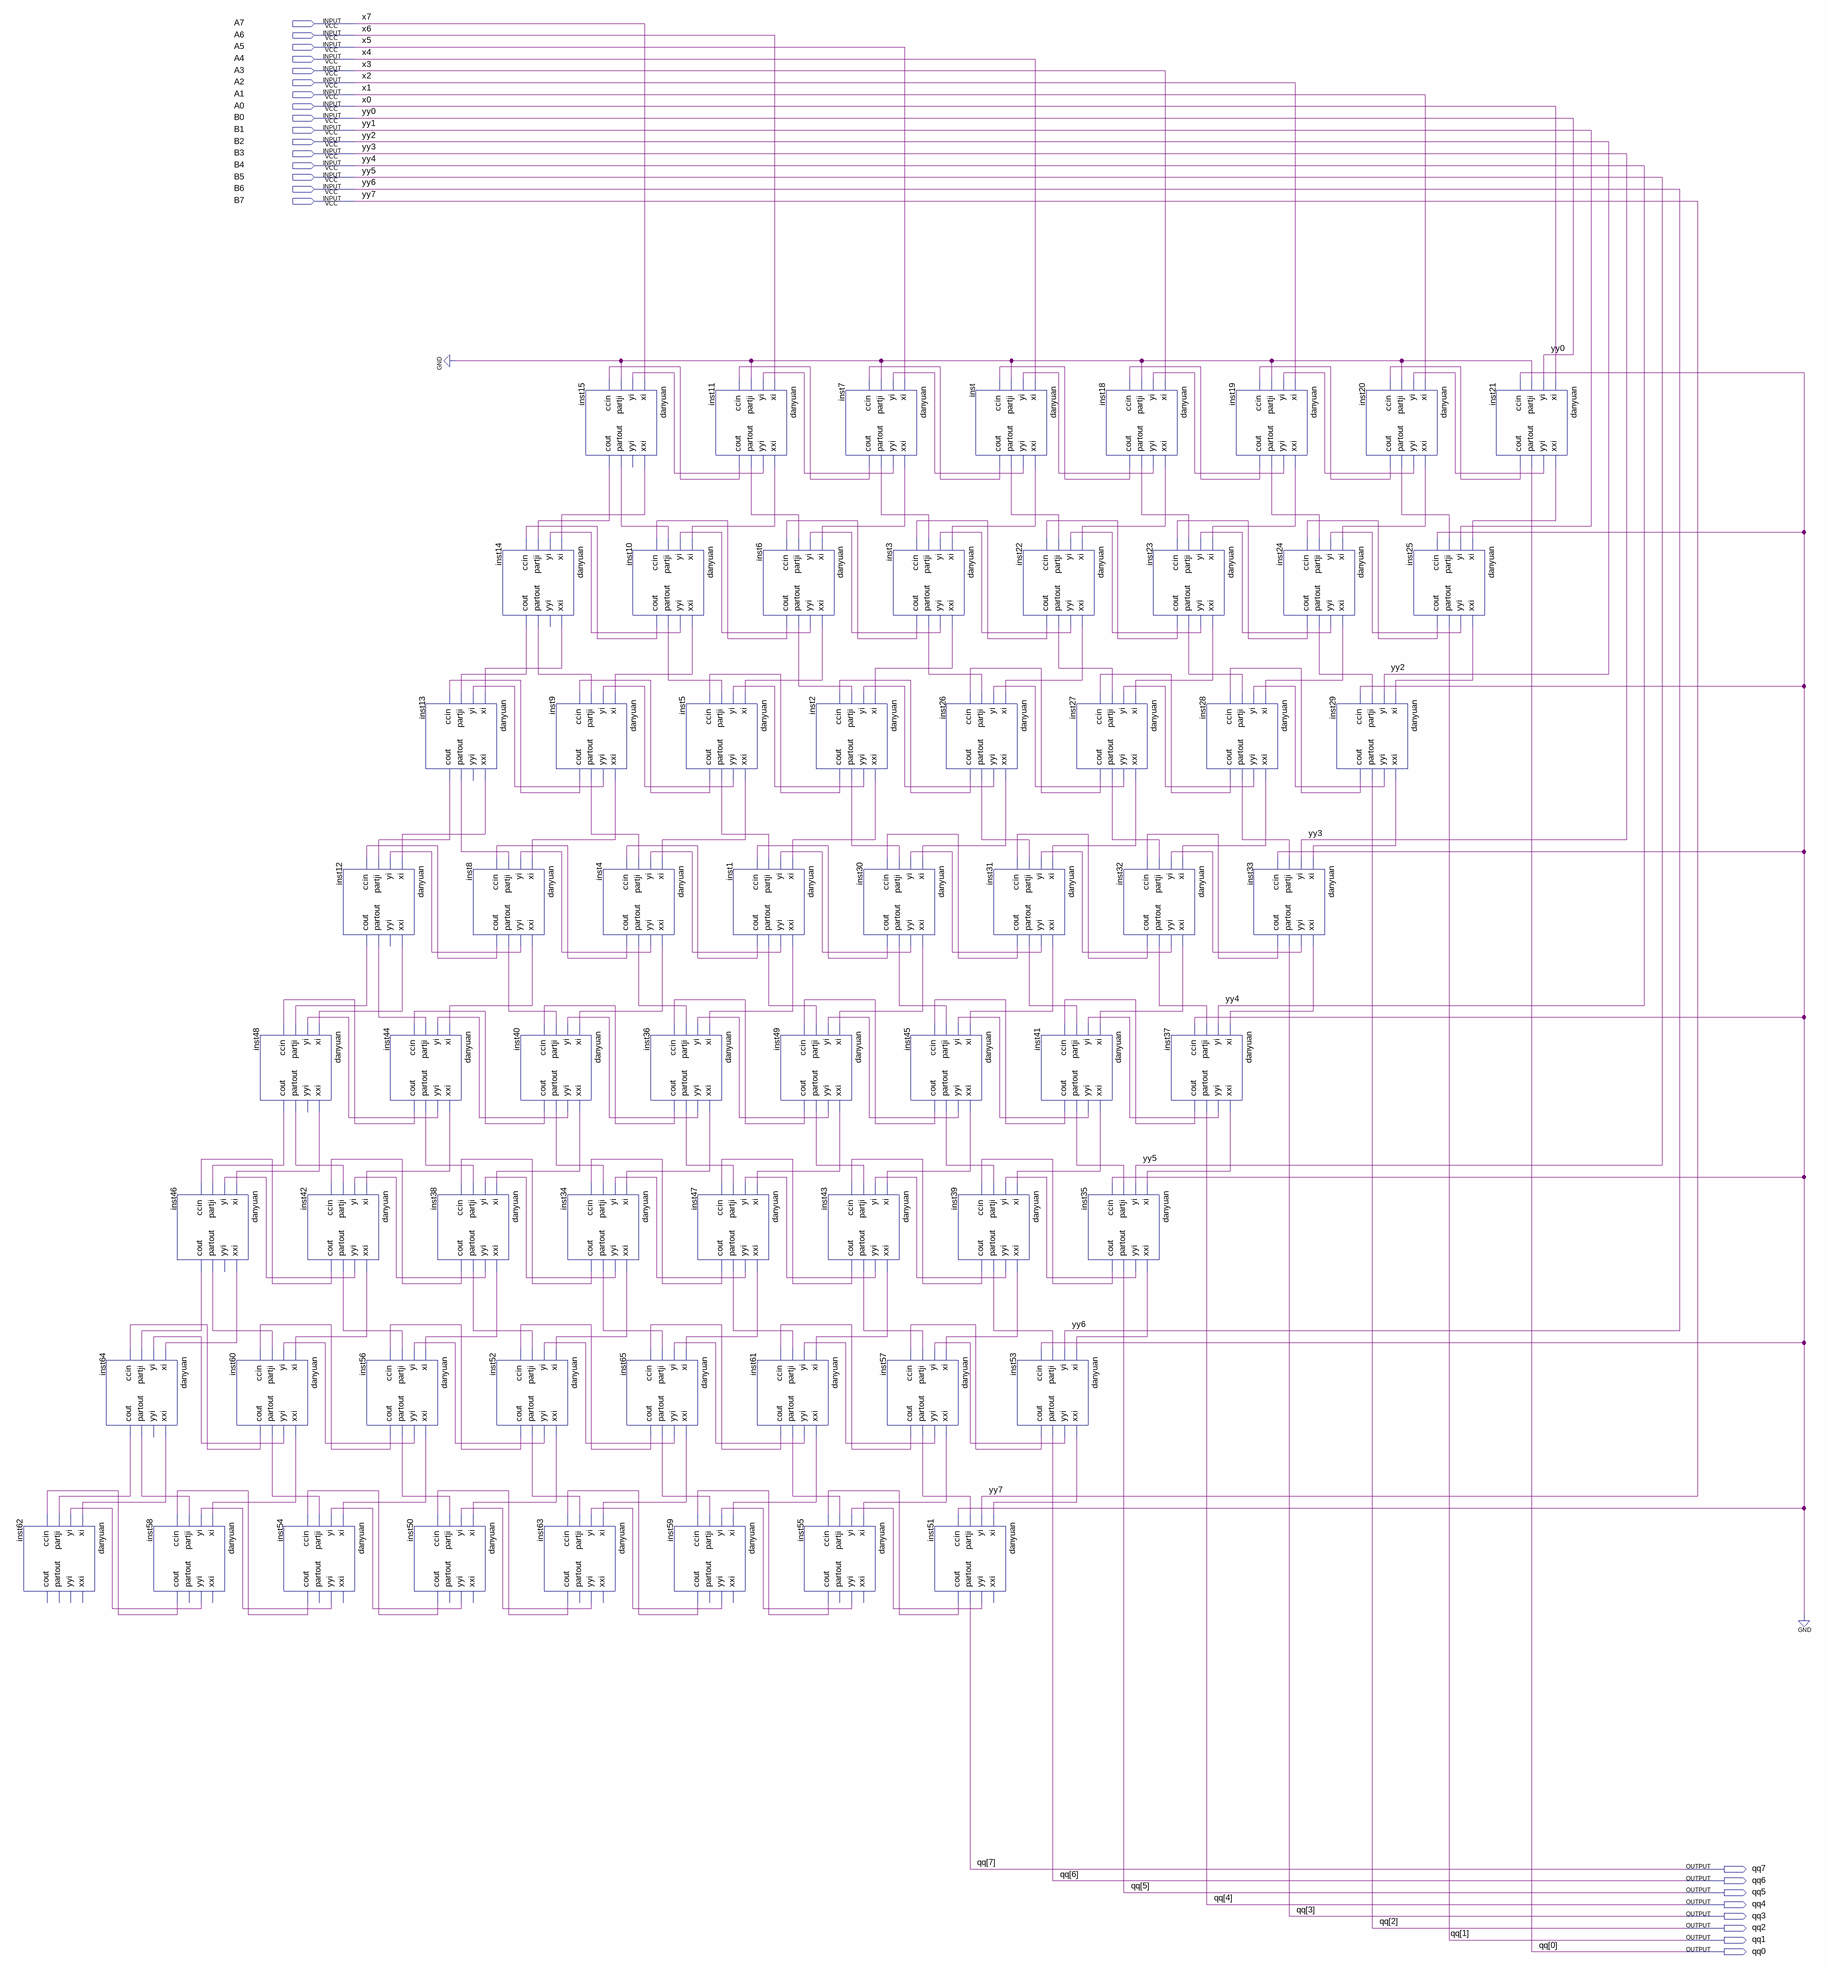
[diagram p0: schematic sheet]
// Quartus schematic multiply.bdf as structural Verilog: 64 symbols, 24 pins
module multiply (
  input  A7,
  input  A6,
  input  A5,
  input  A4,
  input  A3,
  input  A2,
  input  A1,
  input  A0,
  input  B0,
  input  B1,
  input  B2,
  input  B3,
  input  B4,
  input  B5,
  input  B6,
  input  B7,
  output qq7,
  output qq6,
  output qq5,
  output qq4,
  output qq3,
  output qq2,
  output qq1,
  output qq0
);

  wire inst1_cout, inst1_partout, inst1_xxi, inst1_yyi, inst2_cout, inst2_partout, inst2_xxi, inst2_yyi,
       inst3_cout, inst3_partout, inst3_xxi, inst3_yyi, inst4_cout, inst4_partout, inst4_xxi, inst4_yyi,
       inst5_cout, inst5_partout, inst5_xxi, inst5_yyi, inst6_cout, inst6_partout, inst6_xxi, inst6_yyi,
       inst7_cout, inst7_partout, inst7_xxi, inst7_yyi, inst8_cout, inst8_partout, inst8_xxi, inst8_yyi,
       inst9_cout, inst9_partout, inst9_xxi, inst9_yyi, inst10_cout, inst10_partout, inst10_xxi, inst10_yyi,
       inst11_cout, inst11_partout, inst11_xxi, inst11_yyi, inst12_cout, inst12_partout, inst12_xxi,
       inst13_cout, inst13_partout, inst13_xxi, inst14_cout, inst14_partout, inst14_xxi, inst15_cout,
       inst15_partout, inst15_xxi, inst18_cout, inst18_partout, inst18_xxi, inst18_yyi, inst19_cout,
       inst19_partout, inst19_xxi, inst19_yyi, inst20_cout, inst20_partout, inst20_xxi, inst20_yyi,
       inst21_cout, inst21_xxi, inst21_yyi, inst22_cout, inst22_partout, inst22_xxi, inst22_yyi, inst23_cout,
       inst23_partout, inst23_xxi, inst23_yyi, inst24_cout, inst24_partout, inst24_xxi, inst24_yyi,
       inst25_cout, inst25_xxi, inst25_yyi, inst26_cout, inst26_partout, inst26_xxi, inst26_yyi, inst27_cout,
       inst27_partout, inst27_xxi, inst27_yyi, inst28_cout, inst28_partout, inst28_xxi, inst28_yyi,
       inst29_cout, inst29_xxi, inst29_yyi, inst30_cout, inst30_partout, inst30_xxi, inst30_yyi, inst31_cout,
       inst31_partout, inst31_xxi, inst31_yyi, inst32_cout, inst32_partout, inst32_xxi, inst32_yyi,
       inst33_cout, inst33_xxi, inst33_yyi, inst34_cout, inst34_partout, inst34_xxi, inst34_yyi, inst35_cout,
       inst35_xxi, inst35_yyi, inst36_cout, inst36_partout, inst36_xxi, inst36_yyi, inst37_cout, inst37_xxi,
       inst37_yyi, inst38_cout, inst38_partout, inst38_xxi, inst38_yyi, inst39_cout, inst39_partout,
       inst39_xxi, inst39_yyi, inst40_cout, inst40_partout, inst40_xxi, inst40_yyi, inst41_cout,
       inst41_partout, inst41_xxi, inst41_yyi, inst42_cout, inst42_partout, inst42_xxi, inst42_yyi,
       inst43_cout, inst43_partout, inst43_xxi, inst43_yyi, inst44_cout, inst44_partout, inst44_xxi,
       inst44_yyi, inst45_cout, inst45_partout, inst45_xxi, inst45_yyi, inst46_cout, inst46_partout,
       inst46_xxi, inst47_cout, inst47_partout, inst47_xxi, inst47_yyi, inst48_cout, inst48_partout,
       inst48_xxi, inst49_cout, inst49_partout, inst49_xxi, inst49_yyi, inst50_cout, inst50_yyi, inst51_cout,
       inst51_yyi, inst52_cout, inst52_partout, inst52_xxi, inst52_yyi, inst53_cout, inst53_xxi, inst53_yyi,
       inst54_cout, inst54_yyi, inst55_cout, inst55_yyi, inst56_cout, inst56_partout, inst56_xxi, inst56_yyi,
       inst57_cout, inst57_partout, inst57_xxi, inst57_yyi, inst58_cout, inst58_yyi, inst59_cout, inst59_yyi,
       inst60_cout, inst60_partout, inst60_xxi, inst60_yyi, inst61_cout, inst61_partout, inst61_xxi,
       inst61_yyi, inst63_cout, inst63_yyi, inst64_cout, inst64_partout, inst64_xxi, inst65_cout,
       inst65_partout, inst65_xxi, inst65_yyi, inst_cout, inst_partout, inst_xxi, inst_yyi;

  danyuan inst62 (
    .xi(inst64_xxi), .yi(inst58_yyi), .partji(inst64_cout), .ccin(inst58_cout));  // open: xxi, yyi, partout, cout
  danyuan inst64 (
    .xi(inst46_xxi), .yi(inst60_yyi), .partji(inst46_cout), .ccin(inst60_cout), .xxi(inst64_xxi),
    .partout(inst64_partout), .cout(inst64_cout));  // open: yyi
  danyuan inst58 (
    .xi(inst60_xxi), .yi(inst54_yyi), .partji(inst64_partout), .ccin(inst54_cout), .yyi(inst58_yyi),
    .cout(inst58_cout));  // open: xxi, partout
  danyuan inst46 (
    .xi(inst48_xxi), .yi(inst42_yyi), .partji(inst48_cout), .ccin(inst42_cout), .xxi(inst46_xxi),
    .partout(inst46_partout), .cout(inst46_cout));  // open: yyi
  danyuan inst60 (
    .xi(inst42_xxi), .yi(inst56_yyi), .partji(inst46_partout), .ccin(inst56_cout), .xxi(inst60_xxi),
    .yyi(inst60_yyi), .partout(inst60_partout), .cout(inst60_cout));
  danyuan inst48 (
    .xi(inst12_xxi), .yi(inst44_yyi), .partji(inst12_cout), .ccin(inst44_cout), .xxi(inst48_xxi),
    .partout(inst48_partout), .cout(inst48_cout));  // open: yyi
  danyuan inst54 (
    .xi(inst56_xxi), .yi(inst50_yyi), .partji(inst60_partout), .ccin(inst50_cout), .yyi(inst54_yyi),
    .cout(inst54_cout));  // open: xxi, partout
  danyuan inst12 (
    .xi(inst13_xxi), .yi(inst8_yyi), .partji(inst13_cout), .ccin(inst8_cout), .xxi(inst12_xxi),
    .partout(inst12_partout), .cout(inst12_cout));  // open: yyi
  danyuan inst42 (
    .xi(inst44_xxi), .yi(inst38_yyi), .partji(inst48_partout), .ccin(inst38_cout), .xxi(inst42_xxi),
    .yyi(inst42_yyi), .partout(inst42_partout), .cout(inst42_cout));
  danyuan inst44 (
    .xi(inst8_xxi), .yi(inst40_yyi), .partji(inst12_partout), .ccin(inst40_cout), .xxi(inst44_xxi),
    .yyi(inst44_yyi), .partout(inst44_partout), .cout(inst44_cout));
  danyuan inst56 (
    .xi(inst38_xxi), .yi(inst52_yyi), .partji(inst42_partout), .ccin(inst52_cout), .xxi(inst56_xxi),
    .yyi(inst56_yyi), .partout(inst56_partout), .cout(inst56_cout));
  danyuan inst13 (
    .xi(inst14_xxi), .yi(inst9_yyi), .partji(inst14_cout), .ccin(inst9_cout), .xxi(inst13_xxi),
    .partout(inst13_partout), .cout(inst13_cout));  // open: yyi
  danyuan inst38 (
    .xi(inst40_xxi), .yi(inst34_yyi), .partji(inst44_partout), .ccin(inst34_cout), .xxi(inst38_xxi),
    .yyi(inst38_yyi), .partout(inst38_partout), .cout(inst38_cout));
  danyuan inst50 (
    .xi(inst52_xxi), .yi(inst63_yyi), .partji(inst56_partout), .ccin(inst63_cout), .yyi(inst50_yyi),
    .cout(inst50_cout));  // open: xxi, partout
  danyuan inst8 (
    .xi(inst9_xxi), .yi(inst4_yyi), .partji(inst13_partout), .ccin(inst4_cout), .xxi(inst8_xxi),
    .yyi(inst8_yyi), .partout(inst8_partout), .cout(inst8_cout));
  danyuan inst14 (
    .xi(inst15_xxi), .yi(inst10_yyi), .partji(inst15_cout), .ccin(inst10_cout), .xxi(inst14_xxi),
    .partout(inst14_partout), .cout(inst14_cout));  // open: yyi
  danyuan inst40 (
    .xi(inst4_xxi), .yi(inst36_yyi), .partji(inst8_partout), .ccin(inst36_cout), .xxi(inst40_xxi),
    .yyi(inst40_yyi), .partout(inst40_partout), .cout(inst40_cout));
  danyuan inst52 (
    .xi(inst34_xxi), .yi(inst65_yyi), .partji(inst38_partout), .ccin(inst65_cout), .xxi(inst52_xxi),
    .yyi(inst52_yyi), .partout(inst52_partout), .cout(inst52_cout));
  danyuan inst9 (
    .xi(inst10_xxi), .yi(inst5_yyi), .partji(inst14_partout), .ccin(inst5_cout), .xxi(inst9_xxi),
    .yyi(inst9_yyi), .partout(inst9_partout), .cout(inst9_cout));
  danyuan inst34 (
    .xi(inst36_xxi), .yi(inst47_yyi), .partji(inst40_partout), .ccin(inst47_cout), .xxi(inst34_xxi),
    .yyi(inst34_yyi), .partout(inst34_partout), .cout(inst34_cout));
  danyuan inst63 (
    .xi(inst65_xxi), .yi(inst59_yyi), .partji(inst52_partout), .ccin(inst59_cout), .yyi(inst63_yyi),
    .cout(inst63_cout));  // open: xxi, partout
  danyuan inst15 (
    .xi(A7), .yi(inst11_yyi), .partji(1'b0), .ccin(inst11_cout), .xxi(inst15_xxi), .partout(inst15_partout),
    .cout(inst15_cout));  // open: yyi
  danyuan inst4 (
    .xi(inst5_xxi), .yi(inst1_yyi), .partji(inst9_partout), .ccin(inst1_cout), .xxi(inst4_xxi),
    .yyi(inst4_yyi), .partout(inst4_partout), .cout(inst4_cout));
  danyuan inst65 (
    .xi(inst47_xxi), .yi(inst61_yyi), .partji(inst34_partout), .ccin(inst61_cout), .xxi(inst65_xxi),
    .yyi(inst65_yyi), .partout(inst65_partout), .cout(inst65_cout));
  danyuan inst10 (
    .xi(inst11_xxi), .yi(inst6_yyi), .partji(inst15_partout), .ccin(inst6_cout), .xxi(inst10_xxi),
    .yyi(inst10_yyi), .partout(inst10_partout), .cout(inst10_cout));
  danyuan inst36 (
    .xi(inst1_xxi), .yi(inst49_yyi), .partji(inst4_partout), .ccin(inst49_cout), .xxi(inst36_xxi),
    .yyi(inst36_yyi), .partout(inst36_partout), .cout(inst36_cout));
  danyuan inst59 (
    .xi(inst61_xxi), .yi(inst55_yyi), .partji(inst65_partout), .ccin(inst55_cout), .yyi(inst59_yyi),
    .cout(inst59_cout));  // open: xxi, partout
  danyuan inst11 (
    .xi(A6), .yi(inst7_yyi), .partji(1'b0), .ccin(inst7_cout), .xxi(inst11_xxi), .yyi(inst11_yyi),
    .partout(inst11_partout), .cout(inst11_cout));
  danyuan inst5 (
    .xi(inst6_xxi), .yi(inst2_yyi), .partji(inst10_partout), .ccin(inst2_cout), .xxi(inst5_xxi),
    .yyi(inst5_yyi), .partout(inst5_partout), .cout(inst5_cout));
  danyuan inst47 (
    .xi(inst49_xxi), .yi(inst43_yyi), .partji(inst36_partout), .ccin(inst43_cout), .xxi(inst47_xxi),
    .yyi(inst47_yyi), .partout(inst47_partout), .cout(inst47_cout));
  danyuan inst6 (
    .xi(inst7_xxi), .yi(inst3_yyi), .partji(inst11_partout), .ccin(inst3_cout), .xxi(inst6_xxi),
    .yyi(inst6_yyi), .partout(inst6_partout), .cout(inst6_cout));
  danyuan inst1 (
    .xi(inst2_xxi), .yi(inst30_yyi), .partji(inst5_partout), .ccin(inst30_cout), .xxi(inst1_xxi),
    .yyi(inst1_yyi), .partout(inst1_partout), .cout(inst1_cout));
  danyuan inst61 (
    .xi(inst43_xxi), .yi(inst57_yyi), .partji(inst47_partout), .ccin(inst57_cout), .xxi(inst61_xxi),
    .yyi(inst61_yyi), .partout(inst61_partout), .cout(inst61_cout));
  danyuan inst2 (
    .xi(inst3_xxi), .yi(inst26_yyi), .partji(inst6_partout), .ccin(inst26_cout), .xxi(inst2_xxi),
    .yyi(inst2_yyi), .partout(inst2_partout), .cout(inst2_cout));
  danyuan inst49 (
    .xi(inst30_xxi), .yi(inst45_yyi), .partji(inst1_partout), .ccin(inst45_cout), .xxi(inst49_xxi),
    .yyi(inst49_yyi), .partout(inst49_partout), .cout(inst49_cout));
  danyuan inst55 (
    .xi(inst57_xxi), .yi(inst51_yyi), .partji(inst61_partout), .ccin(inst51_cout), .yyi(inst55_yyi),
    .cout(inst55_cout));  // open: xxi, partout
  danyuan inst7 (
    .xi(A5), .yi(inst_yyi), .partji(1'b0), .ccin(inst_cout), .xxi(inst7_xxi), .yyi(inst7_yyi),
    .partout(inst7_partout), .cout(inst7_cout));
  danyuan inst30 (
    .xi(inst26_xxi), .yi(inst31_yyi), .partji(inst2_partout), .ccin(inst31_cout), .xxi(inst30_xxi),
    .yyi(inst30_yyi), .partout(inst30_partout), .cout(inst30_cout));
  danyuan inst43 (
    .xi(inst45_xxi), .yi(inst39_yyi), .partji(inst49_partout), .ccin(inst39_cout), .xxi(inst43_xxi),
    .yyi(inst43_yyi), .partout(inst43_partout), .cout(inst43_cout));
  danyuan inst3 (
    .xi(inst_xxi), .yi(inst22_yyi), .partji(inst7_partout), .ccin(inst22_cout), .xxi(inst3_xxi),
    .yyi(inst3_yyi), .partout(inst3_partout), .cout(inst3_cout));
  danyuan inst45 (
    .xi(inst31_xxi), .yi(inst41_yyi), .partji(inst30_partout), .ccin(inst41_cout), .xxi(inst45_xxi),
    .yyi(inst45_yyi), .partout(inst45_partout), .cout(inst45_cout));
  danyuan inst57 (
    .xi(inst39_xxi), .yi(inst53_yyi), .partji(inst43_partout), .ccin(inst53_cout), .xxi(inst57_xxi),
    .yyi(inst57_yyi), .partout(inst57_partout), .cout(inst57_cout));
  danyuan inst26 (
    .xi(inst22_xxi), .yi(inst27_yyi), .partji(inst3_partout), .ccin(inst27_cout), .xxi(inst26_xxi),
    .yyi(inst26_yyi), .partout(inst26_partout), .cout(inst26_cout));
  danyuan inst39 (
    .xi(inst41_xxi), .yi(inst35_yyi), .partji(inst45_partout), .ccin(inst35_cout), .xxi(inst39_xxi),
    .yyi(inst39_yyi), .partout(inst39_partout), .cout(inst39_cout));
  danyuan inst51 (
    .xi(inst53_xxi), .yi(B7), .partji(inst57_partout), .ccin(1'b0), .yyi(inst51_yyi), .partout(qq7),
    .cout(inst51_cout));  // open: xxi
  danyuan inst (
    .xi(A4), .yi(inst18_yyi), .partji(1'b0), .ccin(inst18_cout), .xxi(inst_xxi), .yyi(inst_yyi),
    .partout(inst_partout), .cout(inst_cout));
  danyuan inst31 (
    .xi(inst27_xxi), .yi(inst32_yyi), .partji(inst26_partout), .ccin(inst32_cout), .xxi(inst31_xxi),
    .yyi(inst31_yyi), .partout(inst31_partout), .cout(inst31_cout));
  danyuan inst22 (
    .xi(inst18_xxi), .yi(inst23_yyi), .partji(inst_partout), .ccin(inst23_cout), .xxi(inst22_xxi),
    .yyi(inst22_yyi), .partout(inst22_partout), .cout(inst22_cout));
  danyuan inst41 (
    .xi(inst32_xxi), .yi(inst37_yyi), .partji(inst31_partout), .ccin(inst37_cout), .xxi(inst41_xxi),
    .yyi(inst41_yyi), .partout(inst41_partout), .cout(inst41_cout));
  danyuan inst53 (
    .xi(inst35_xxi), .yi(B6), .partji(inst39_partout), .ccin(1'b0), .xxi(inst53_xxi), .yyi(inst53_yyi),
    .partout(qq6), .cout(inst53_cout));
  danyuan inst27 (
    .xi(inst23_xxi), .yi(inst28_yyi), .partji(inst22_partout), .ccin(inst28_cout), .xxi(inst27_xxi),
    .yyi(inst27_yyi), .partout(inst27_partout), .cout(inst27_cout));
  danyuan inst35 (
    .xi(inst37_xxi), .yi(B5), .partji(inst41_partout), .ccin(1'b0), .xxi(inst35_xxi), .yyi(inst35_yyi),
    .partout(qq5), .cout(inst35_cout));
  danyuan inst18 (
    .xi(A3), .yi(inst19_yyi), .partji(1'b0), .ccin(inst19_cout), .xxi(inst18_xxi), .yyi(inst18_yyi),
    .partout(inst18_partout), .cout(inst18_cout));
  danyuan inst32 (
    .xi(inst28_xxi), .yi(inst33_yyi), .partji(inst27_partout), .ccin(inst33_cout), .xxi(inst32_xxi),
    .yyi(inst32_yyi), .partout(inst32_partout), .cout(inst32_cout));
  danyuan inst23 (
    .xi(inst19_xxi), .yi(inst24_yyi), .partji(inst18_partout), .ccin(inst24_cout), .xxi(inst23_xxi),
    .yyi(inst23_yyi), .partout(inst23_partout), .cout(inst23_cout));
  danyuan inst37 (
    .xi(inst33_xxi), .yi(B4), .partji(inst32_partout), .ccin(1'b0), .xxi(inst37_xxi), .yyi(inst37_yyi),
    .partout(qq4), .cout(inst37_cout));
  danyuan inst19 (
    .xi(A2), .yi(inst20_yyi), .partji(1'b0), .ccin(inst20_cout), .xxi(inst19_xxi), .yyi(inst19_yyi),
    .partout(inst19_partout), .cout(inst19_cout));
  danyuan inst28 (
    .xi(inst24_xxi), .yi(inst29_yyi), .partji(inst23_partout), .ccin(inst29_cout), .xxi(inst28_xxi),
    .yyi(inst28_yyi), .partout(inst28_partout), .cout(inst28_cout));
  danyuan inst24 (
    .xi(inst20_xxi), .yi(inst25_yyi), .partji(inst19_partout), .ccin(inst25_cout), .xxi(inst24_xxi),
    .yyi(inst24_yyi), .partout(inst24_partout), .cout(inst24_cout));
  danyuan inst33 (
    .xi(inst29_xxi), .yi(B3), .partji(inst28_partout), .ccin(1'b0), .xxi(inst33_xxi), .yyi(inst33_yyi),
    .partout(qq3), .cout(inst33_cout));
  danyuan inst29 (
    .xi(inst25_xxi), .yi(B2), .partji(inst24_partout), .ccin(1'b0), .xxi(inst29_xxi), .yyi(inst29_yyi),
    .partout(qq2), .cout(inst29_cout));
  danyuan inst20 (
    .xi(A1), .yi(inst21_yyi), .partji(1'b0), .ccin(inst21_cout), .xxi(inst20_xxi), .yyi(inst20_yyi),
    .partout(inst20_partout), .cout(inst20_cout));
  danyuan inst25 (
    .xi(inst21_xxi), .yi(B1), .partji(inst20_partout), .ccin(1'b0), .xxi(inst25_xxi), .yyi(inst25_yyi),
    .partout(qq1), .cout(inst25_cout));
  danyuan inst21 (
    .xi(A0), .yi(B0), .partji(1'b0), .ccin(1'b0), .xxi(inst21_xxi), .yyi(inst21_yyi), .partout(qq0),
    .cout(inst21_cout));

  // Other names for the same wires on the sheet: x0 = A0; x1 = A1; x2 = A2; x3 = A3; x4 = A4; x5 = A5; x6 = A6;
  //   x7 = A7; yy0 = B0; yy1 = B1; yy2 = B2; yy3 = B3; yy4 = B4; yy5 = B5; yy6 = B6; yy7 = B7
endmodule
